# EAGLE design HMLFO (EAGLE 9.6.2)
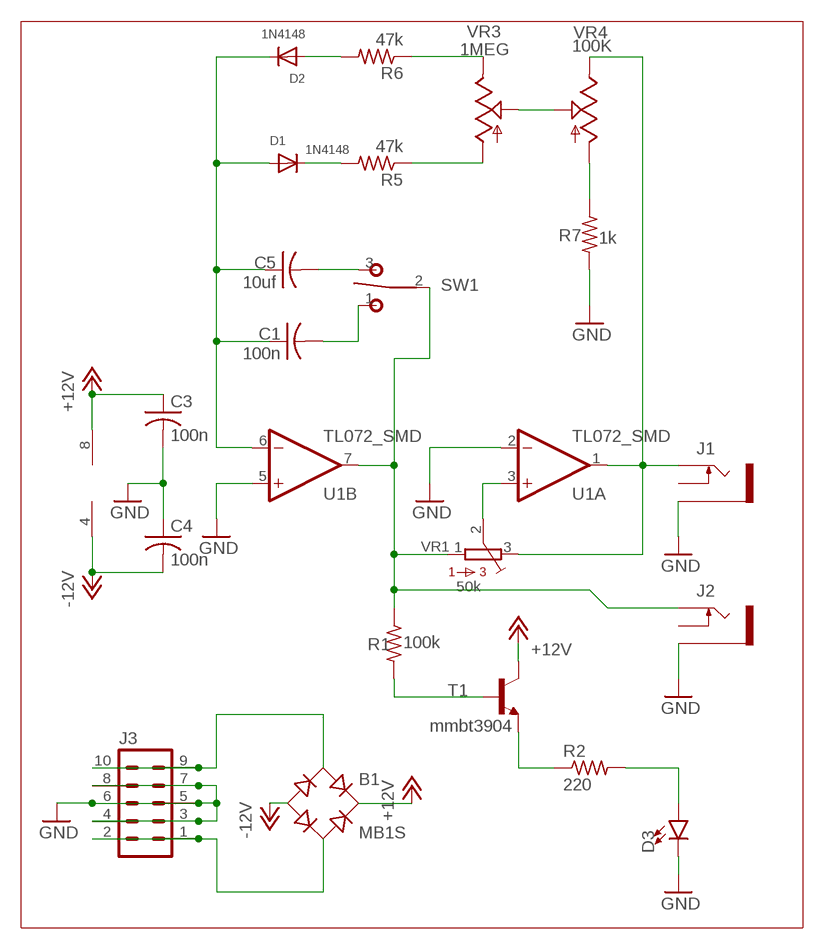
[diagram p0: schematic, sheet 1]

## Parts
B1  MB1S  [SOIC-4]
C1  100n  C-USC0603K  [C0603K]
C3  100n  C-USC0603K  [C0603K]
C4  100n  C-USC0603K  [C0603K]
C5  10uf  C-USC0805K  [C0805K]
D1  1N4148  DIODESOD-323F  [SOD-323F]
D2  1N4148  DIODESOD-323F  [SOD-323F]
D3  LED3MM  [LED_3MM]
J1  THONKICONNNEW  [WQP-PJ301M-12_JACK]
J2  THONKICONNNEW  [WQP-PJ301M-12_JACK]
J3  MA05-2  [MA05-2]
R1  100k  R-US_R0603  [R0603]
R2  220  R-US_R0603  [R0603]
R5  47k  R-US_R0603  [R0603]
R6  47k  R-US_R0603  [R0603]
R7  1k  R-US_R0603  [R0603]
SW1  T-80-T-SPDT-ON-OFF-ON  [M9040P]
T1  mmbt3904  MMBT3904LT1-NPN-SOT23-BEC  [SOT23-BEC]
U1  TL072_SMD  [SO08]
VR1  50k  BOURNS_3362P_TRIMMERP  [BOURNS_3362P_TRIMMER]
VR3  1MEG  9MM_SNAP-IN_POT_  [9MM_SNAP-IN_POT]
VR4  100K  9MM_SNAP-IN_POT_  [9MM_SNAP-IN_POT]

## Nets
+12V: B1.+ C3.1 T1.C U1.8(P:V+)
-12V: B1.- C4.2 U1.4(P:V-)
GND: C3.2 C4.1 D3.K(C) J1.P$3_SLEEVE(SLEEVE) J2.P$3_SLEEVE(SLEEVE) J3.3 J3.4 J3.5 J3.6 J3.7 J3.8 R7.2 U1.2(A:-IN) U1.5(B:+IN)
N$1: C1.1 C5.1 D1.A D2.C U1.6(B:-IN)
N$2: VR3.2(S) VR4.2(S)
N$3: R6.1 VR3.3(E)
N$4: R5.1 VR3.1(A)
N$5: D1.C R5.2
N$6: D2.A R6.2
N$7: U1.3(A:+IN) VR1.2
N$8: J2.P$1_TIP(TIP) R1.1 SW1.2(P) U1.7(B:OUT) VR1.1
N$9: J1.P$1_TIP(TIP) U1.1(A:OUT) VR1.3 VR4.3(E)
N$10: R7.1 VR4.1(A)
N$11: R1.2 T1.B
N$12: R2.1 T1.E
N$13: D3.A R2.2
N$14: C1.2 SW1.1(O)
N$15: C5.2 SW1.3(S)
N$16: B1.~1(AC1) J3.9 J3.10
N$18: B1.~2(AC2) J3.1 J3.2
Unconnected: J1.P$2_SWITCH(SWITCH) J2.P$2_SWITCH(SWITCH)

## Library data of the parts
B1 = rectifier:MB*S: Bridge Rectifier Source: http://www.fairchildsemi.com/ds/MB/MB6S.pdf
C1 C3-C5 = rcl:C-US: CAPACITOR, American symbol; SPICEPREFIX: C
D1 D2 = adafruit:DIODE: Diode SMADIODE - SMA Surface Mount Package 20V 1A Schottky Diode Digikey: 641-1014-6-ND DO-1N4148 - Through Hole Small Current Diode SOD-123 20V 1 A (.5mV Vf) Schottky Diode - Digikey: MBRX120TPMSCT-ND SOD-323 10V 570mA (.38mV Vf, 3ns) Schottky Diode - Digikey: ZLLS410CT-ND SOD-523 30V 30mA Schottky Diode (RB751S-40TE61) - Digikey: RB751S-40TE61CT-ND SOT23-R/W - SOT23 Package (R = Solder Paste/Reflow Ovens, W = Hand-Soldering) BAT54Film 40V 300mA - Digikey: 497-7162-1-ND
D3 = SparkFun-LED:LED: LED (Generic) Standard schematic elements and footprints for 5mm, 3mm, 1206, and 0603 sized LEDs. Generic LEDs with no color specified.; PROD_ID: DIO-08794
J1 J2 = MusicThingModular:THONKICONN: 3.5mm socket for Eurorack modular synths
J3 = con-lstb:MA05-2: PIN HEADER; OC_FARNELL: unknown; OC_NEWARK: unknown
R1 R2 R5-R7 = rcl:R-US_: RESISTOR, American symbol; SPICEPREFIX: R
SW1 = MusicThingModular:T-80-T-SPDT-ON-OFF-ON
T1 = MusicThingModular:*-NPN-: NPN Transistror BF959 corrected 2008.03.06
U1 = MusicThingModular:TL072: Generic Dual Op Amp
VR1 = MusicThingModular:BOURNS_3362P_TRIMMER: 3362 Series 1/4" Square Trimmer
VR3 VR4 = MusicThingModular:9MM_SNAP-IN_POT: 9mm vertical snap-in pot, Alpha / Panasonic style

## Board
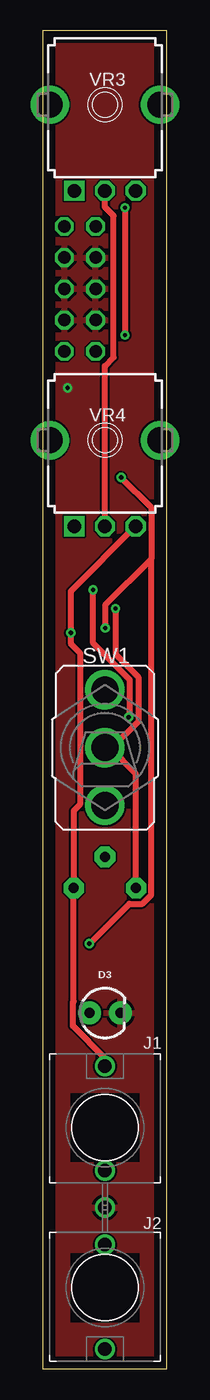
[diagram p1: board, top side]
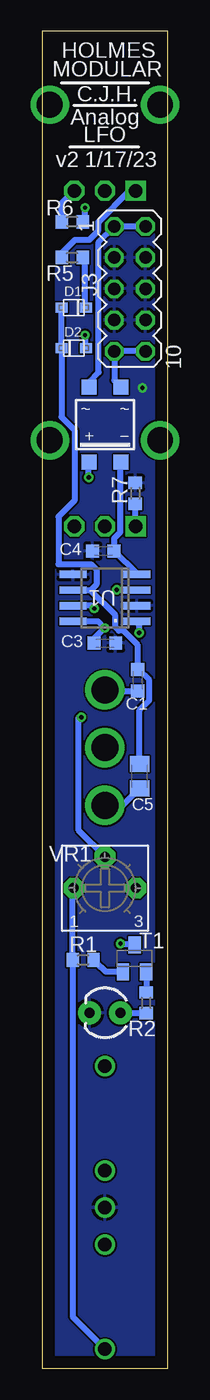
[diagram p2: board, bottom side, seen from below]

Size 10.14 x 108.89 mm. Coordinates in mm from the lower left corner, seen from the top.
Outline: 0,0 10.14,0 10.14,108.89 0,108.89 0,0
Copper layers (1*16): Top 0.035mm / dielectric 1.5mm / Bottom 0.035mm
Design rules "default": minimum track width 6mil, minimum drill 0.35mm, track to track 6mil, track to pad 6mil, pad to pad 6mil, via to via 6mil, smd to smd 6mil, copper to edge 40mil, drill to drill 6mil, minimum pad ring 10mil, minimum via ring 8mil, stop-mask expansion 4mil, vias tented up to drill 0mil, thermal gap 10mil

### Footprints (pad centres in the part's own frame; a part is rotated, then mirrored left to right if it is on the bottom)
SOIC-4 = smd 1.2 x 1.2: + 1.3,3.05; - -1.3,3.05; ~1 -1.3,-3.05; ~2 1.3,-3.05
C0603K = smd 1.05 x 1.08: 1 -0.875,0; 2 0.875,0
C0805K = smd 1.3 x 1.6: 1 -1,0; 2 1,0
SOD-323F = smd 1 x 0.8: A -1,0; C 1,0
LED_3MM = drill 0.813 pad 1.88: A -1.27,0; K 1.27,0
WQP-PJ301M-12_JACK = drill 1.1: P$1_TIP 0,5; P$2_SWITCH 0,-3.5; P$3_SLEEVE 0,-6.5
MA05-2 = drill 1.016 octagon: 1 -5.08,-1.27; 2 -5.08,1.27; 3 -2.54,-1.27; 4 -2.54,1.27; 5 0,-1.27; 6 0,1.27; 7 2.54,-1.27; 8 2.54,1.27; 9 5.08,-1.27; 10 5.08,1.27
R0603 = smd 1 x 1.1: 1 -0.85,0; 2 0.85,0
M9040P = drill 2.2: 1 0,4.699 | drill 2.2 pad 3: 2 0,0; 3 0,-4.699
SOT23-BEC = smd 1 x 1.4: B -0.95,-1.1; C 0,1.1; E 0.95,-1.1
SO08 = smd 0.6 x 2.2: 1 -1.905,-2.6; 2 -0.635,-2.6; 3 0.635,-2.6; 4 1.905,-2.6; 5 1.905,2.6; 6 0.635,2.6; 7 -0.635,2.6; 8 -1.905,2.6
BOURNS_3362P_TRIMMER = drill 0.813 pad 1.676 octagon: 1 -2.54,0; 2 0,2.54; 3 2.54,0
9MM_SNAP-IN_POT = drill 1.1 square: 1 -2.5,-7 | drill 1.1 octagon: 2 0,-7; 3 2.5,-7 | drill 2.1 pad 2.794: CHASSIS1 -4.5,0; CHASSIS2 4.5,0

### Placement (x,y rotation side)
B1  5.08,76.83 180 bottom
C1  2.41,56.03 270 bottom
C3  5.08,59.05 0 bottom
C4  5.21,66.55 0 bottom
C5  2.26,48.22 270 bottom
D1  7.62,86.36 0 bottom
D2  7.62,83.06 180 bottom
D3  5.08,28.96 0 top
J1  5.08,19.62 0 top
J2  5.08,6.6 180 top
J3  3.05,87.88 270 bottom
R1  6.86,33.27 0 bottom
R2  1.71,29.78 270 bottom
R5  7.75,90.42 0 bottom
R6  7.75,93.34 0 bottom
R7  2.6,71.25 90 bottom
SW1  5.08,50.55 0 top
T1  2.67,33.4 0 bottom
U1  5.08,62.74 90 bottom
VR1  5.08,39.12 0 bottom
VR3  5.08,102.87 0 top
VR4  5.08,75.56 0 top

### Tracks (layer width: path | path; a pad name or v marks a point on that pad's centre or on a via)
+12V  (via drill 0.35)
  Top 0.508: v6.4,72.54 8.87,70.08 8.87,65.91 | 8.87,65.91 5.1,62.14 5.1,61.09 5.11,61.08 v5.11,60.27 | 8.87,65.91 8.87,38.58 8.14,37.85 7.06,37.85 v3.81,34.59
  Bottom 0.152: 6.4,73.76 B1.+ | 2.74,34.59 T1.C
  Bottom 0.508: v6.4,72.54 6.4,73.76 | C3.1 5.96,59.42 v5.11,60.27 5.66,60.83 U1.8 | v3.81,34.59 2.74,34.59
-12V
  Bottom 0.508: U1.4 2.48,64.7 C4.2 4.33,67.57 3.85,68.06 3.85,73.72 B1.-
GND  (via drill 0.35)
  other vias: 2.03,79.83
  pour Bottom: 0,0 10.16,0 10.16,108.97 0.25,108.97 0,108.71
  pour Top: 0,0 0,108.97 10.16,108.97 10.16,0
N$1
  Bottom 0.508: D1.A D2.C 8.62,77.46 7.57,76.4 7.57,70.64 8.86,69.34 8.86,65.47 6.22,65.47 5.78,65.02 5.78,63.82 6.22,63.37 6.29,63.37 | U1.6 6.29,63.37 | 6.29,63.37 4.24,61.33 4.24,60.37 3.94,60.06 3.57,60.06 2.44,58.93 2.44,56.93 C1.1 2.34,56.91 1.47,56.04 1.47,54.39 2.26,53.59 C5.1
N$2
  Top 0.508: VR4.2 5.08,81.61 5.79,82.32 5.79,93.83 5.08,94.54 VR3.2
N$3
  Bottom 0.508: R6.1 8.6,94.85 VR3.3
N$4
  Bottom 0.508: R5.1 8.6,90.81 7.52,91.88 6.36,91.88 5.61,92.63 5.61,93.33 3.06,95.87 VR3.1
N$5
  Bottom 0.508: D1.C 6.75,86.49 6.75,90.27 R5.2
N$6  (via drill 0.35)
  Top 0.508: v6.71,94.49 v6.71,84.12
  Bottom 0.508: D2.A 6.68,83.12 6.68,84.1 v6.71,84.12 | R6.2 6.71,93.54 v6.71,94.49
N$7  (via drill 0.35)
  Top 0.152: 4.12,63.25 v4.12,63.4
  Top 0.508: v7.01,53.01 7.09,53.09 7.09,56.08 4.12,59.06 4.12,63.25
  Bottom 0.508: v4.12,63.4 4.09,63.37 U1.3 | v7.01,53.01 7.23,53.01 7.23,43.83 5.08,41.68 VR1.2
N$8  (via drill 0.35)
  Top 0.508: VR1.1 7.6,39.13 7.6,48.42 5.48,50.55 SW1.2 5.66,50.55 7.79,52.69 7.79,56.31 5.94,58.16 v5.94,61.87
  Bottom 0.508: J2.P$1_TIP 7.71,4.23 R1.1 7.71,39.03 VR1.1 | v5.94,61.87 6.17,62.1 U1.7
N$9  (via drill 0.35)
  Top 0.508: J1.P$1_TIP 5.08,25.27 2.46,27.89 2.46,29.83 2.54,29.91 VR1.3 2.54,45.41 3.04,45.91 3.04,58.26 2.29,59.02 v2.29,59.89 2.29,63.27 VR4.3
  Bottom 0.152: 2.44,60.71 2.44,60.81 U1.1
  Bottom 0.508: v2.29,59.89 2.29,60.55 2.44,60.71
N$10
  Bottom 0.508: VR4.1 2.58,70.37 R7.1
N$11
  Bottom 0.508: T1.B 5.01,32.3 5.42,32.7 5.44,32.7 R1.2
N$12
  Bottom 0.508: T1.E R2.1
N$13
  Bottom 0.508: R2.2 3.79,28.93 D3.A
N$14
  Bottom 0.508: SW1.1 5.19,55.13 2.44,55.13 C1.2
N$15
  Bottom 0.508: C5.2 3.63,45.85 SW1.3
N$16
  Bottom 0.508: J3.10 J3.9 4.32,80.42 B1.~1
N$18
  Bottom 0.508: J3.2 J3.1 5.59,91.69 5.59,81.09 6.38,80.3 B1.~2

### Text on the board
bNames: HOLMES | MODULAR | C.J.H. | Analog | LFO | v2 1/17/23 | .